# Altium schematic sheet 04.SchDoc
size 817 x 513 mm
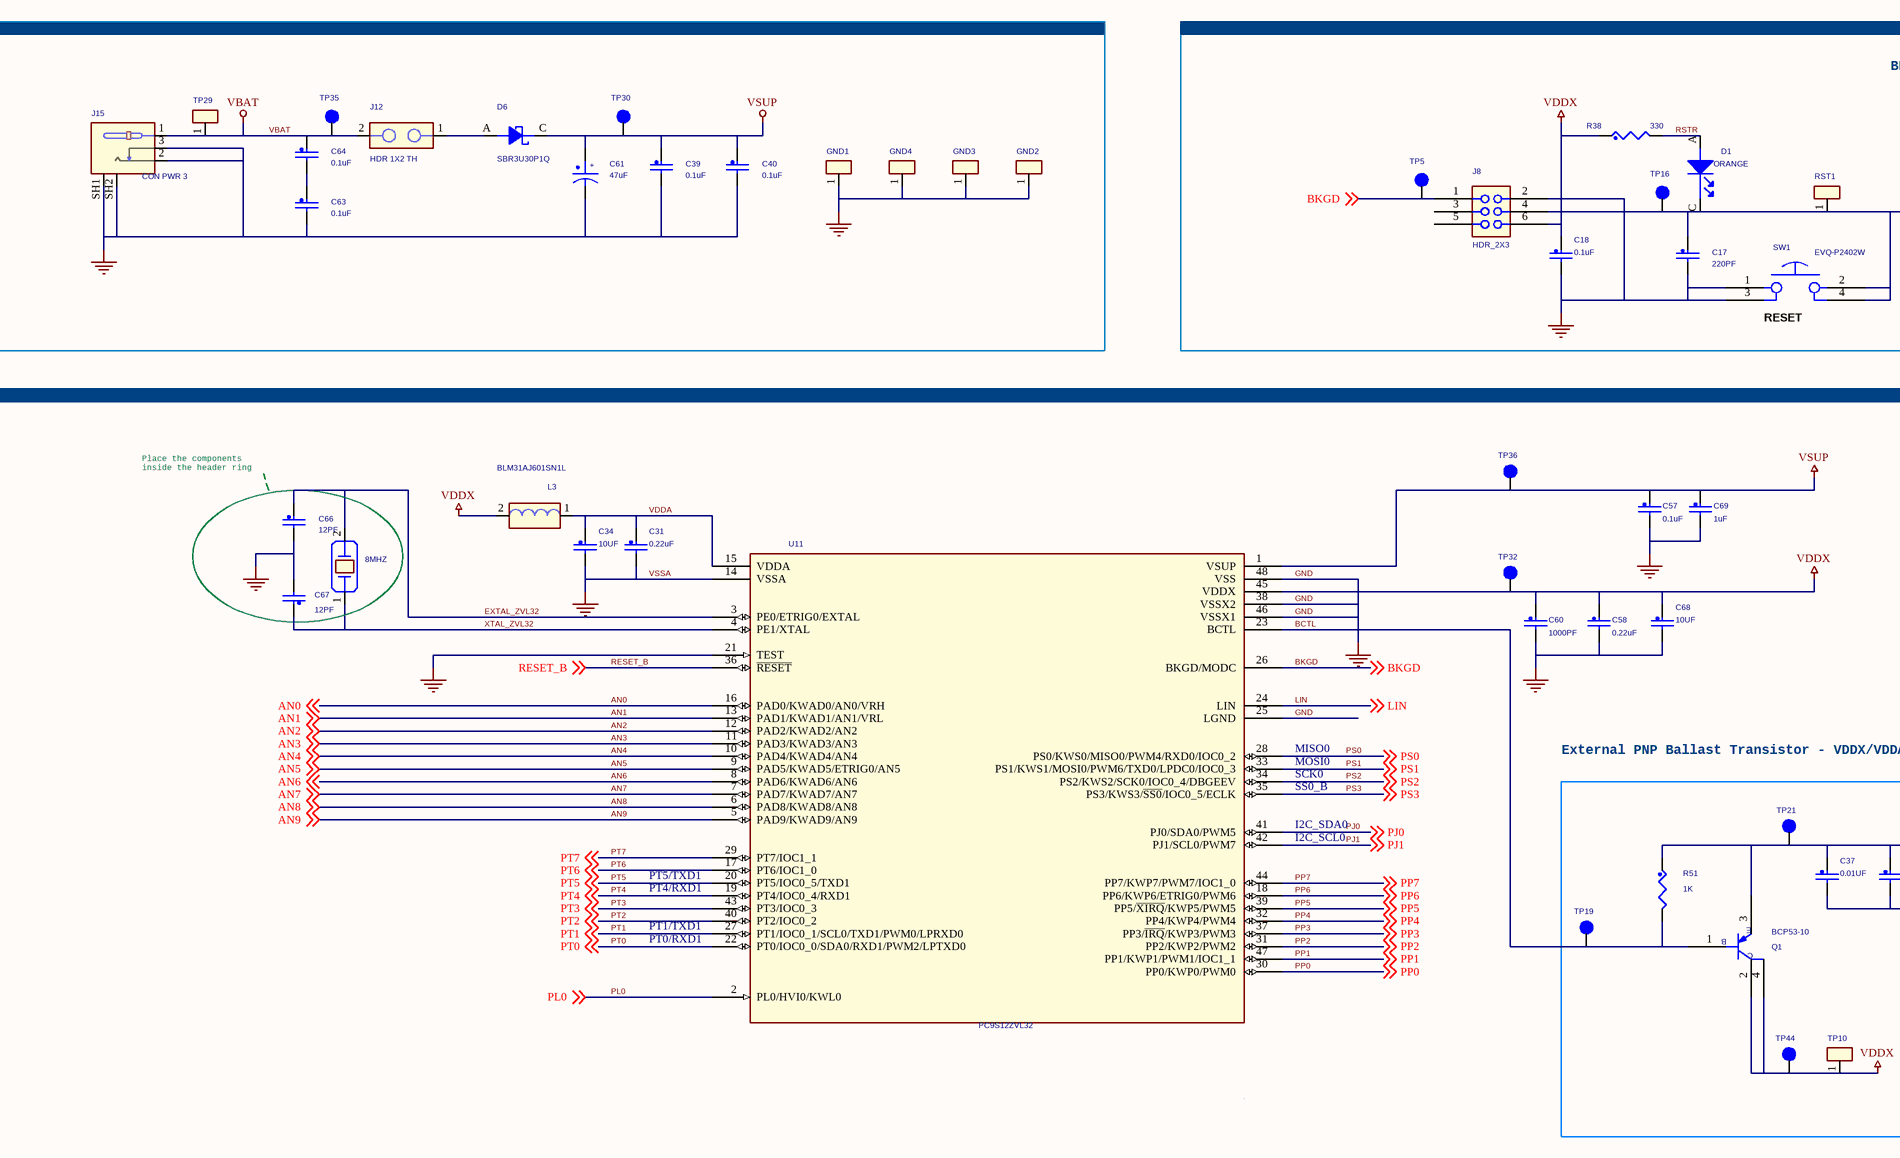
[diagram p0: 04.SchDoc, top left]
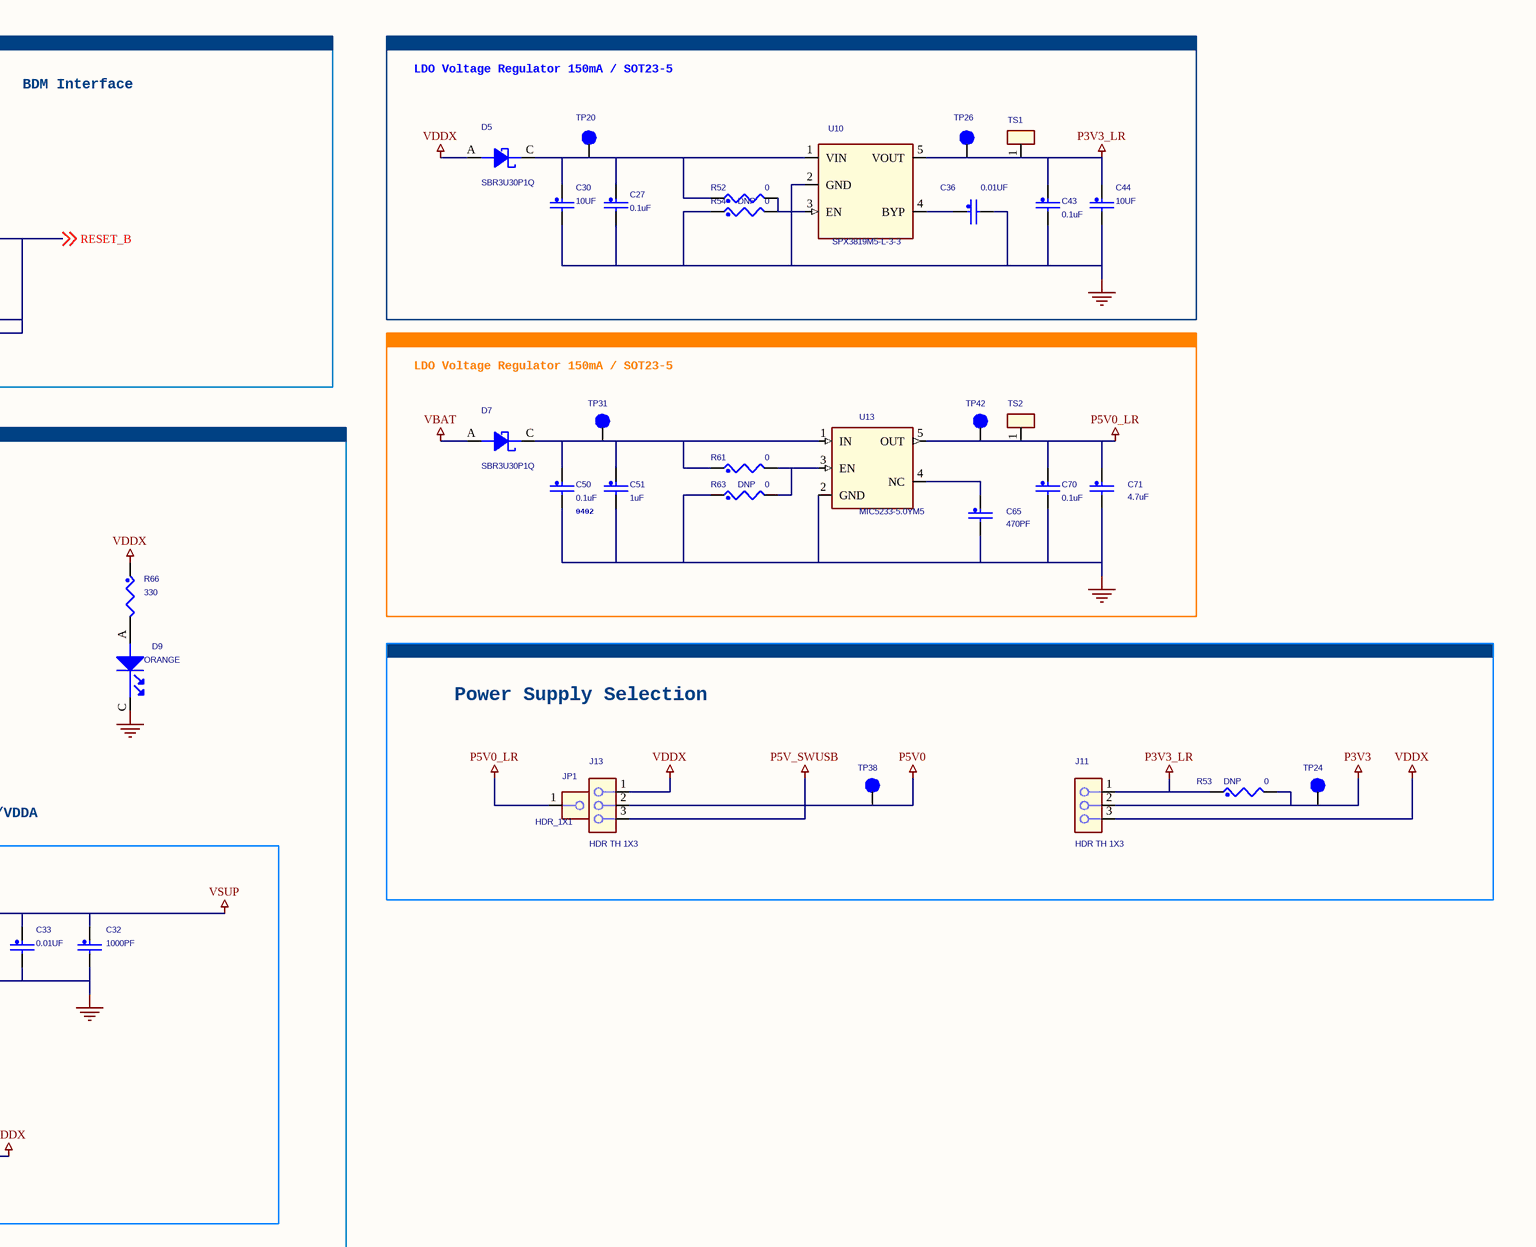
[diagram p1: 04.SchDoc, top right]
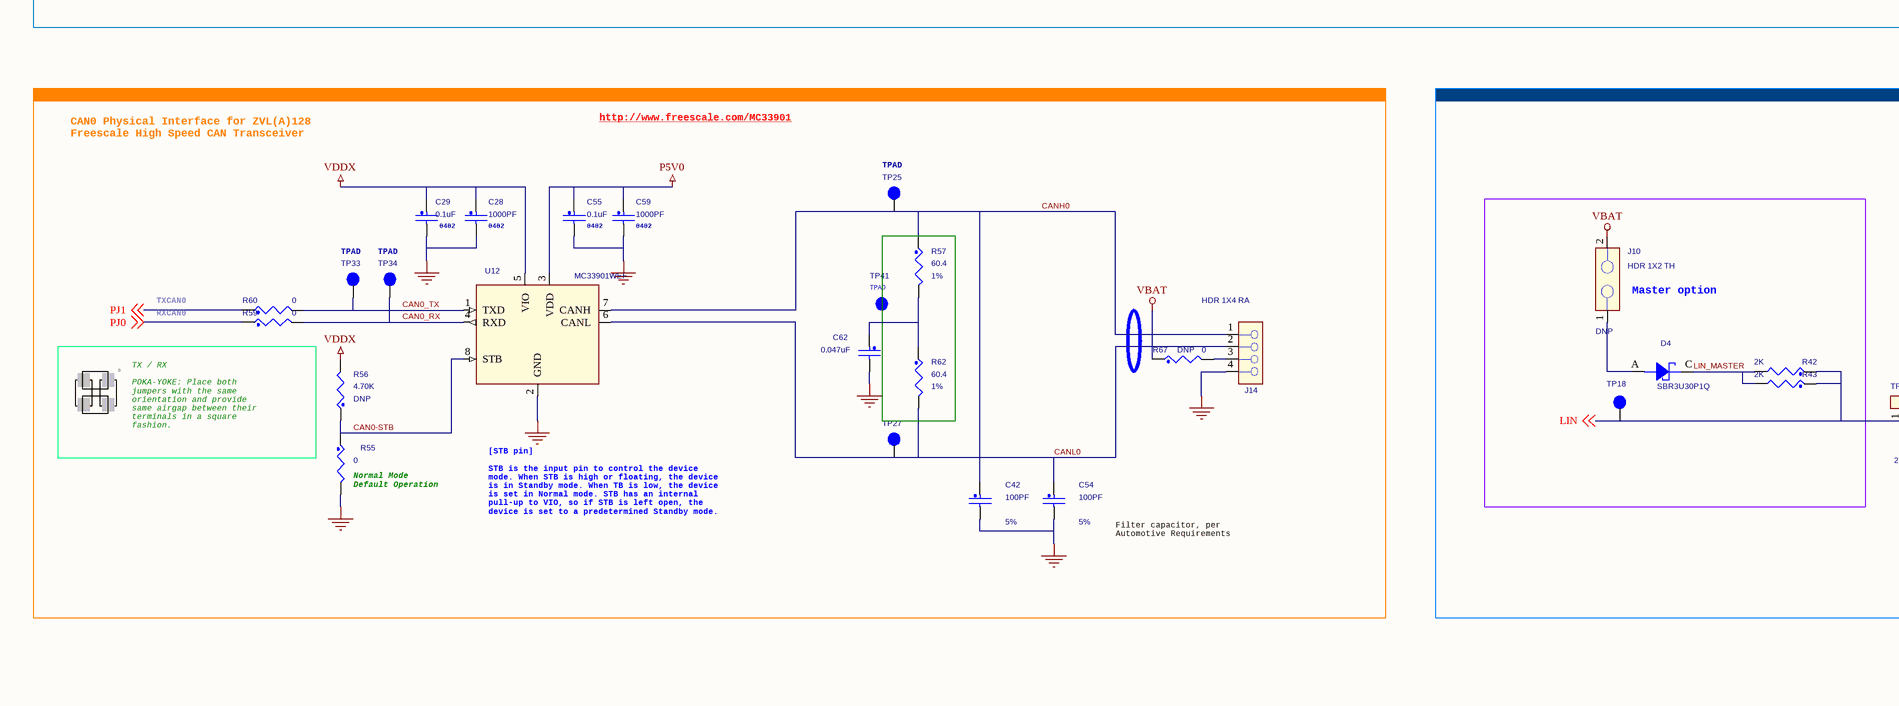
[diagram p2: 04.SchDoc, bottom left]
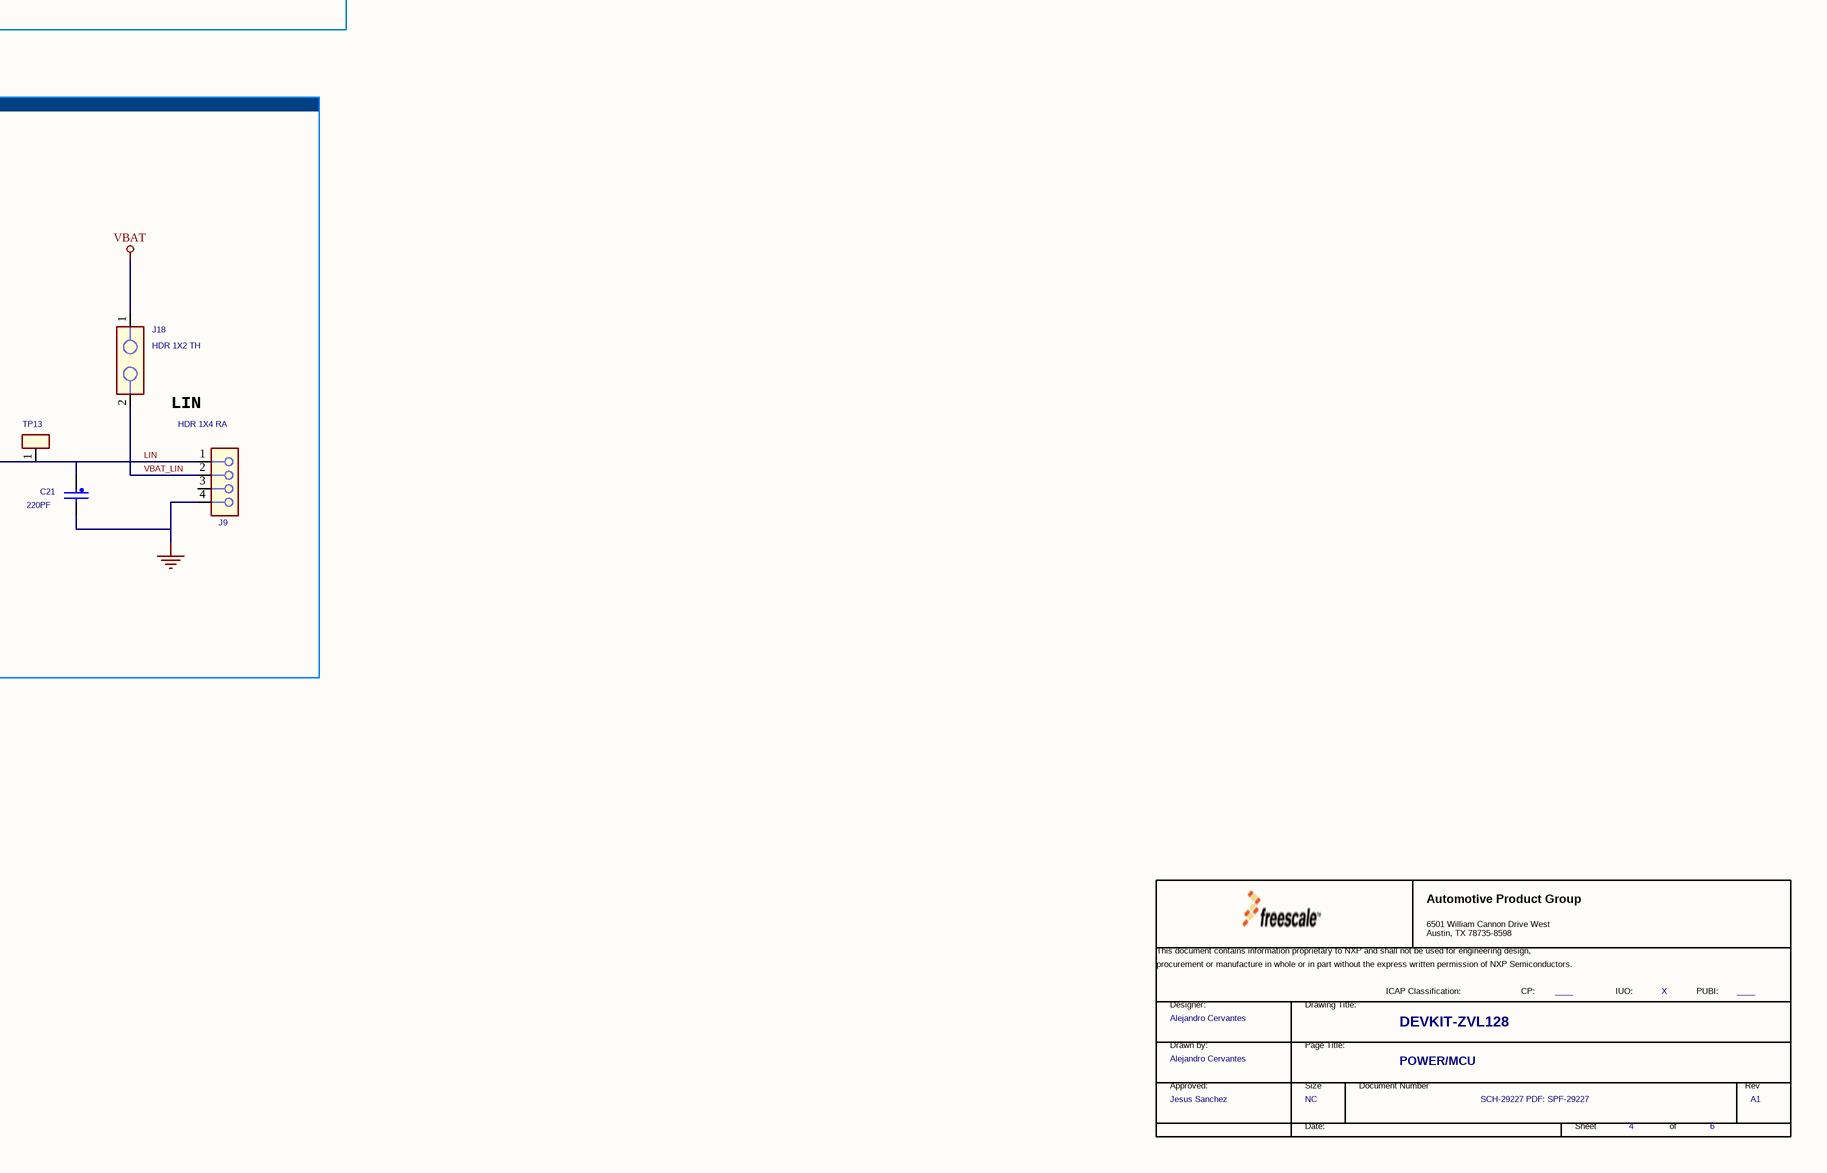
[diagram p3: 04.SchDoc, bottom right]

## Parts
*  FCP: ____  FIUO: X  DrawnBy: Alejandro Cervantes  Approver: Jesus Sanchez  PageTitle: POWER/MCU  Page Count: 6  Page Number: 4  Page Size: NC  Title: DEVKIT-ZVL128  RevCode: A1  Doc: SCH-29227 PDF: SPF-29227  (hidden comment: TitleBlock_AMPG)  (graphical)
C17  220PF  [CC0402_25]
C18  0.1uF  [CC0402_25]
C21  220PF  [CC0603_OV]
C27  0.1uF  [CC0402_25]
C28  1000PF  [CC0402_25]
C29  0.1uF  [CC0402_25]
C30  10UF  [CC0603_OV]
C31  0.22uF  [CC0402_25]
C32  1000PF  [CC0402_25]
C33  0.01UF  [CC0402_25]
C34  10UF  [CC0805_OV]
C36  0.01UF  [CC0402_25]
C37  0.01UF  [CC0402_25]
C39  0.1uF  [CC0402_25]
C40  0.1uF  [CC0402_25]
C42  100PF  TOL: 5%  [CC0402_25]
C43  0.1uF  [CC0402_25]
C44  10UF  [CC0603_OV]
C50  0.1uF  [CC0402_25]
C51  1uF  [CC0805_OV]
C54  100PF  TOL: 5%  [CC0402_25]
C55  0.1uF  [CC0402_25]
C57  0.1uF  [CC0402_25]
C58  0.22uF  [CC0402_25]
C59  1000PF  [CC0402_25]
C60  1000PF  [CC0402_25]
C61  47uF  [cce6p8x6p8]
C62  0.047uF  [CC0603_OV]
C63  0.1uF  [CC0402_25]
C64  0.1uF  [CC0402_25]
C65  470PF  [CC0603_OV]
C66  12PF  [CC0402_25]
C67  12PF  [CC0402_25]
C68  10UF  [CC0805_OV]
C69  1uF  [CC0805_OV]
C70  0.1uF  [CC0402_25]
C71  4.7uF  [CC0805_OV]
D1  ORANGE  [LED_0603]
D4  SBR3U30P1Q  [powerdi-123_3mmx2mm]
D5  SBR3U30P1Q  [powerdi-123_3mmx2mm]
D6  SBR3U30P1Q  [powerdi-123_3mmx2mm]
D7  SBR3U30P1Q  [powerdi-123_3mmx2mm]
D9  ORANGE  [LED_0603]
GND1  TESTLOOP  [testpoint_135_070mil]  (value not drawn)
GND2  TESTLOOP  [testpoint_135_070mil]  (value not drawn)
GND3  TESTLOOP  [testpoint_135_070mil]  (value not drawn)
GND4  TESTLOOP  [testpoint_135_070mil]  (value not drawn)
J8  HDR_2X3  [HDR203]
J9  HDR 1X4 RA  [con_hdr_4m_100_th_ra]
J10  HDR 1X2 TH  ASSY_OPT: DNP  [HDR102]
J11  HDR TH 1X3  [HDR103]
J12  HDR 1X2 TH  [HDR102]
J13  HDR TH 1X3  [HDR103]
J14  HDR 1X4 RA  [con_hdr_4m_100_th_ra]
J15  CON PWR 3  [con3_pwr_jack_th_pj051a]
J18  HDR 1X2 TH  [HDR102]
JP1  HDR_1X1  [HDR101]
L3  BLM31AJ601SN1L  [IND_1206]
Q1  BCP53-10  [sot223]
R38  330  [RC0402_25]
R42  2K  [RC0805_OV]
R43  2K  [RC0805_OV]
R51  1K  [RC0603_OV]
R52  0  [RC0402_25]
R53  0  ASSY_OPT: DNP  [RC0603_OV]
R54  0  ASSY_OPT: DNP  [RC0402_25]
R55  0  [RC0603_OV]
R56  4.70K  ASSY_OPT: DNP  [RC0603_OV]
R57  60.4  TOL: 1%  [RC1210]
R59  0  [RC0603_OV]
R60  0  [RC0603_OV]
R61  0  [RC0603_OV]
R62  60.4  TOL: 1%  [RC1210]
R63  0  ASSY_OPT: DNP  [RC0603_OV]
R66  330  [RC0402_25]
R67  0  ASSY_OPT: DNP  [RC0805_OV]
RST1  TESTLOOP  [testpoint_135_070mil]  (value not drawn)
SW1  EVQ-P2402W  [sw4_spst_4p8X3p6_2p5]
TP5  TPAD_028  [TPAD_028]  (value not drawn)
TP10  TESTLOOP  [testpoint_135_070mil]  (value not drawn)
TP13  TESTLOOP  [testpoint_135_070mil]  (value not drawn)
TP16  TPAD_028  [TPAD_028]  (value not drawn)
TP18  TPAD_028  [TPAD_028]  (value not drawn)
TP19  TPAD_030  [TPAD_030]  (value not drawn)
TP20  TPAD_028  [TPAD_028]  (value not drawn)
TP21  TPAD_030  [TPAD_030]  (value not drawn)
TP24  TPAD_030  [TPAD_030]  (value not drawn)
TP25  TPAD_028  [TPAD_028]  (value not drawn)
TP26  TPAD_028  [TPAD_028]  (value not drawn)
TP27  TPAD_028  [TPAD_028]  (value not drawn)
TP29  TESTLOOP  [testpoint_135_070mil]  (value not drawn)
TP30  TPAD_028  [TPAD_028]  (value not drawn)
TP31  TPAD_030  [TPAD_030]  (value not drawn)
TP32  TPAD_030  [TPAD_030]  (value not drawn)
TP33  TPAD_028  [TPAD_028]  (value not drawn)
TP34  TPAD_028  [TPAD_028]  (value not drawn)
TP35  TPAD_028  [TPAD_028]  (value not drawn)
TP36  TPAD_030  [TPAD_030]  (value not drawn)
TP38  TPAD_030  [TPAD_030]  (value not drawn)
TP41  TPAD_028  [TPAD_028]  (value not drawn)
TP42  TPAD_030  [TPAD_030]  (value not drawn)
TP44  TPAD_030  [TPAD_030]  (value not drawn)
TS1  TESTLOOP  [testpoint_135_070mil]  (value not drawn)
TS2  TESTLOOP  [testpoint_135_070mil]  (value not drawn)
U10  SPX3819M5-L-3-3  [SOT23_5S]
U11  PC9S12ZVL32  [LQFP48]
U12  MC33901WEF  [SO8_1P27_4X5]
U13  MIC5233-5.0YM5  [sot-23-5]
Y2  8MHZ  [xtal2_3p3x2p6]

## Blocks framed on the sheet
BDM Interface: C17 C18 D1 J8 R38 RST1 SW1 TP5 TP16
LDO Voltage Regulator 150mA / SOT23-5: C27 C30 C36 C43 C44 D5 R52 R54 TP20 TP26 TS1 U10
LDO Voltage Regulator 150mA / SOT23-5: C50 C51 C65 C70 C71 D7 R61 R63 TP31 TP42 TS2 U13
External PNP Ballast Transistor - VDDX/VDDA: C31-C34 C37 C57 C58 C60 C66-C69 D9 L3 Q1 R51 R66 TP10 TP19 TP21 TP32 TP36 TP44 U11 Y2
Power Supply Selection: J11 J13 JP1 R53 TP24 TP38
http://www.freescale.com/MC33901: C28 C29 C42 C54 C55 C59 C62 J14 R55-R57 R59 R60 R62 R67 TP25 TP27 TP33 TP34 TP41 U12
LIN: C21 J9 J18 TP13
Master option: D4 J10 R42 R43 TP18

## Nets
GND: C17.2 C18.2 C21.2 C27.2 C28.2 C29.2 C30.2 C31.2 C32.2 C33.2 C34.2 C36.2 C37.2 C39.2 C40.2 C42.2 C43.2 C44.2 C50.2 C51.2 C54.2 C55.2 C57.2 C58.2 C59.2 C60.2 C61.2 C62.2 C63.2 C65.2 C66.2 C67.2 C68.2 C69.2 C70.2 C71.2 D9.C(CATHODE) GND1.1 GND2.1 GND3.1 GND4.1 J8.2(B1) J9.4 J14.4 J15.2 J15.3 J15.SH1(SHIELD1) J15.SH2(SHIELD2) R54.1 R55.2 R63.1 SW1.1 SW1.3 U10.2(GND) U11.14(VSSA) U11.21(TEST) U11.25(LGND) U11.38(VSSX2) U11.46(VSSX1) U11.48(VSS) U12.2(GND) U13.2(GND)  [also labelled VSSA]
P3V3: J11.2 R53.2 TP24.1(Pin1)
P3V3_LR: C43.1 C44.1 J11.1 R53.1 TP26.1(Pin1) TS1.1 U10.5(VOUT)
P5V0: C55.1 C59.1 J13.2 TP38.1(Pin1) U12.3(VDD)
P5V0_LR: C70.1 C71.1 JP1.1 TP42.1(Pin1) TS2.1 U13.5(OUT)
P5V_SWUSB: J13.3
VBAT: C64.1 D7.A J10.2 J12.2 J15.1 J18.1 R67.1 TP29.1 TP35.1(Pin1)
VDDX: C18.1 C28.1 C29.1 C58.1 C60.1 C68.1 D5.A J8.6(B3) J11.3 J13.1 L3.2 Q1.2(COLLECTOR) Q1.4(COLLECTOR1) R38.1 R56.2 R66.1 TP10.1 TP32.1(Pin1) TP44.1(Pin1) U11.45(VDDX) U12.5(VIO)
VSUP: C32.1 C33.1 C37.1 C39.1 C40.1 C57.1 C61.1 C69.1 D6.C Q1.3(EMITTER) R51.1 TP21.1(Pin1) TP30.1(Pin1) TP36.1(Pin1) U11.1(VSUP)
AN0: U11.16(PAD0/KWAD0/AN0/VRH) ; off-sheet AN0
AN1: U11.13(PAD1/KWAD1/AN1/VRL) ; off-sheet AN1
AN2: U11.12(PAD2/KWAD2/AN2) ; off-sheet AN2
AN3: U11.11(PAD3/KWAD3/AN3) ; off-sheet AN3
AN4: U11.10(PAD4/KWAD4/AN4) ; off-sheet AN4
AN5: U11.9(PAD5/KWAD5/ETRIG0/AN5) ; off-sheet AN5
AN6: U11.8(PAD6/KWAD6/AN6) ; off-sheet AN6
AN7: U11.7(PAD7/KWAD7/AN7) ; off-sheet AN7
AN8: U11.6(PAD8/KWAD8/AN8) ; off-sheet AN8
AN9: U11.5(PAD9/KWAD9/AN9) ; off-sheet AN9
BCTL: Q1.1(BASE) R51.2 TP19.1(Pin1) U11.23(BCTL)
BKGD: J8.1(A1) TP5.1(Pin1) U11.26(BKGD/MODC) ; off-sheet BKGD
CAN0-STB: R55.1 R56.1 U12.8(STB)
CAN0_RX: R59.2 TP34.1(Pin1) U12.4(RXD)
CAN0_TX: R60.2 TP33.1(Pin1) U12.1(TXD)
CANH0: C42.1 J14.1 R57.1 TP25.1(Pin1) U12.7(CANH)
CANL0: C54.1 J14.2 R62.2 TP27.1(Pin1) U12.6(CANL)
EXTAL_ZVL32: C66.1 U11.3(PE0/ETRIG0/EXTAL) Y2.2
LIN: C21.1 J9.1 R42.1 R43.1 TP13.1 TP18.1(Pin1) U11.24(LIN) ; off-sheet LIN
LIN_MASTER: D4.C R42.2 R43.2
PJ0: R59.1 U11.41(PJ0/SDA0/PWM5) ; off-sheet PJ0
PJ1: R60.1 U11.42(PJ1/SCL0/PWM7) ; off-sheet PJ1
PL0: U11.2(PL0/HVI0/KWL0) ; off-sheet PL0
PP0: U11.30(PP0/KWP0/PWM0) ; off-sheet PP0
PP1: U11.47(PP1/KWP1/PWM1/IOC1_1) ; off-sheet PP1
PP2: U11.31(PP2/KWP2/PWM2) ; off-sheet PP2
PP3: U11.37(PP3/~{IRQ}/KWP3/PWM3) ; off-sheet PP3
PP4: U11.32(PP4/KWP4/PWM4) ; off-sheet PP4
PP5: U11.39(PP5/~{XIRQ}/KWP5/PWM5) ; off-sheet PP5
PP6: U11.18(PP6/KWP6/ETRIG0/PWM6) ; off-sheet PP6
PP7: U11.44(PP7/KWP7/PWM7/IOC1_0) ; off-sheet PP7
PS0: U11.28(PS0/KWS0/MISO0/PWM4/RXD0/IOC0_2) ; off-sheet PS0
PS1: U11.33(PS1/KWS1/MOSI0/PWM6/TXD0/LPDC0/IOC0_3) ; off-sheet PS1
PS2: U11.34(PS2/KWS2/SCK0/IOC0_4/DBGEEV) ; off-sheet PS2
PS3: U11.35(PS3/KWS3/~{SS0}/IOC0_5/ECLK) ; off-sheet PS3
PT0: U11.22(PT0/IOC0_0/SDA0/RXD1/PWM2/LPTXD0) ; off-sheet PT0
PT1: U11.27(PT1/IOC0_1/SCL0/TXD1/PWM0/LPRXD0) ; off-sheet PT1
PT2: U11.40(PT2/IOC0_2) ; off-sheet PT2
PT3: U11.43(PT3/IOC0_3) ; off-sheet PT3
PT4: U11.19(PT4/IOC0_4/RXD1) ; off-sheet PT4
PT5: U11.20(PT5/IOC0_5/TXD1) ; off-sheet PT5
PT6: U11.17(PT6/IOC1_0) ; off-sheet PT6
PT7: U11.29(PT7/IOC1_1) ; off-sheet PT7
RESET_B: C17.1 D1.C(CATHODE) J8.4(B2) RST1.1 SW1.2 SW1.4 TP16.1(Pin1) U11.36(~{RESET}) ; off-sheet RESET_B
RSTR: D1.A(ANODE) R38.2
VBAT_LIN: J9.2 J18.2
VDDA: C31.1 C34.1 L3.1 U11.15(VDDA)
XTAL_ZVL32: C67.1 U11.4(PE1/XTAL) Y2.1
NetC27_1: C27.1 C30.1 D5.C R52.1 TP20.1(Pin1) U10.1(VIN)
NetC36_1: C36.1 U10.4(BYP)
NetC50_1: C50.1 C51.1 D7.C R61.1 TP31.1(Pin1) U13.1(IN)
NetC62_1: C62.1 R57.2 R62.1 TP41.1(Pin1)
NetC63_1: C63.1 C64.2
NetC65_1: C65.1 U13.4(NC)
NetD4_A: D4.A J10.1
NetD6_A: D6.A J12.1
NetD9_A: D9.A(ANODE) R66.2
NetJ14_3: J14.3 R67.2
NetR52_2: R52.2 R54.2 U10.3(EN)
NetR61_2: R61.2 R63.2 U13.3(EN)

Not connected (* = marked no-connect by the designer): J8 3(A2) 5(A3); J9 3

## Notes on the sheet
- (near SW1) RESET
- (near C66) Place the components
  inside the header ring
- 0402
- MOSI0
- SCK0
- SS0_B
- MISO0
- I2C_SDA0
- I2C_SCL0
- PT1/TXD1
- PT4/RXD1
- PT5/TXD1
- PT0/RXD1
- CAN0 Physical Interface for ZVL(A)128
  Freescale High Speed CAN Transceiver
- (near TP25) TPAD
- TPAD
- (near C29) 0402
- (near C28) 0402
- (near C55) 0402
- (near C59) 0402
- TXCAN0
- RXCAN0
- (near TP41) TPAD
- TX / RX
  POKA-YOKE: Place both
  jumpers with the same
  orientation and provide
  same airgap between their
  terminals in a square
  fashion.
- (near R55) Normal Mode
  Default Operation
- [STB pin]
  STB is the input pin to control the device
  mode. When STB is high or floating, the device
  is in Standby mode. When TB is low, the device
  is set in Normal mode. STB has an internal
  pull-up to VIO, so if STB is left open, the
  device is set to a predetermined Standby mode.
- Filter capacitor, per
  Automotive Requirements
- (in symbol CAP_POL) +
- (in symbol TitleBlock_AMPG) Automotive Product Group; 6501 William Cannon Drive West / Austin, TX 78735-8598; This document contains information proprietary to NXP and shall not be used for engineering design,; procurement or manufacture in whole or in part without the express written permission of NXP Semiconductors.; ICAP Classification:; CP:; IUO:; PUBI:; Designer:; Drawing Title:; Drawn by:; Page Title:; Approved:; Size; Document Number; Rev; Date:; Sheet; of
- (in symbol TRAN_PNP_SOT223) E; B; C

## Library data of the parts
* = TitleBlock_AMPG: OrgName: Freescale Semiconductor; OrgAddr1: 6501 William Cannon Drive West; OrgAddr2: Austin, TX 78735-8598; PUBI: ____; Designer: Alejandro Cervantes; Page Create Date: March  8, 1995
C17 = CAP_NP: CAP CER 220PF 50V 5% C0G 0402; CLASS: DISCRETE; AGILE_PN: 150-30297; MFG_NAME01: KEMET; MFG_PN01: C0402C221J5GAC; CAD_APPROVED: Yes; FPLIST: CC0402_25,CC0402_HD,0402_CC; Tolerance: 5%; ROHS: Yes; HEIGHT: 0.55MM; VOLTAGE: 50V
C18 C27 C40 C43 C63 C64 C70 = CAP_NP: CAP CER 0.1uF 50V 10% X7R 0402; CLASS: DISCRETE; AGILE_PN: 150-79069; MFG_NAME01: MURATA; MFG_PN01: GRM155R71H104KE14D; CAD_APPROVED: Yes; FPLIST: CC0402_25,CC0402_HD,0402_CC; Tolerance: 10%; ROHS: Yes; HEIGHT: 0.55MM; VOLTAGE: 50V
  C18: TOL: 10%
C21 = CAP_NP: CAP CER 220PF 50V 10% X7R 0603; CLASS: DISCRETE; AGILE_PN: 150-75200; MFG_NAME01: KEMET; MFG_PN01: C0603C221K5RAC; CAD_APPROVED: Yes; FPLIST: CC0603_OV,CC0603,0603_CC; Tolerance: 10%; ROHS: Yes; HEIGHT: 0.9652MM; VOLTAGE: 50V
C28 = CAP_NP: CAP CER 1000pF 50V 10% X7R AEC-Q200 0402; CLASS: DISCRETE; AGILE_PN: 150-79040; MFG_NAME01: MURATA; MFG_PN01: GCM155R71H102KA37D; CAD_APPROVED: Yes; FPLIST: CC0402_25,CC0402_HD,0402_CC; TOL: 10%; Tolerance: 10%; ROHS: Yes; HEIGHT: 0.55MM; VOLTAGE: 50V
C29 = CAP_NP: CAP CER 0.1uF 50V 10% X7R 0402; CLASS: DISCRETE; FPLIST: CC0402_25,CC0402_HD,0402_CC; CAD_APPROVED: Yes; MFG_PN01: GRM155R71H104KE14D; MFG_NAME01: MURATA; AGILE_PN: 150-79069; PRIORITY_PN: 021-00295; VOLTAGE: 50V; HEIGHT: 0.55MM; ROHS: Yes; Tolerance: 10%; TOL: 10%
C30 C44 = CAP_NP: CAP CER 10uF 25V 20% X5R 0603; CLASS: DISCRETE; AGILE_PN: 150-79272; MFG_NAME01: Murata; MFG_PN01: GRM188R61E106MA73D; CAD_APPROVED: Yes; FPLIST: CC0805_OV,CC0805,0805_CC; Tolerance: 20%; ROHS: Yes; HEIGHT: 1MM; VOLTAGE: 25V
C31 C58 = CAP_NP: CAP CER 0.22UF 16V 10% X7R 0402; CLASS: DISCRETE; AGILE_PN: 150-78886; MFG_NAME01: Murata; MFG_PN01: GRM155R71C224KA12D; CAD_APPROVED: Yes; FPLIST: CC0402_25,CC0402_HD,0402_CC; Tolerance: 10%; ROHS: Yes; HEIGHT: 0.55MM; VOLTAGE: 16V
C32 = CAP_NP: CAP CER 1000PF 50V 10% X7R 0402; CLASS: DISCRETE; AGILE_PN: 150-75271; Tolerance: +10%; MFG_NAME01: AVX; MFG_PN01: 04025C102KAT2A; CAD_APPROVED: Yes; FPLIST: CC0402_25,CC0402_HD,0402_CC; VOLTAGE: 50VDC; ROHS: Yes; HEIGHT: 0.635 MM
C33 C37 = CAP_NP: CAP CER 0.01uF 50V 5% X7R 0402; CLASS: DISCRETE; AGILE_PN: 150-30234; MFG_NAME01: VENKEL COMPANY; MFG_PN01: C0402X7R500-103JNE; CAD_APPROVED: Yes; FPLIST: CC0402_25,CC0402_HD,0402_CC; TOL: 5%; Tolerance: 5%; ROHS: Yes; HEIGHT: 0.55MM; VOLTAGE: 50V
C34 = CAP_NP: CAP CER 10UF 10V 10% X7R 0805; CLASS: DISCRETE; FPLIST: CC0805_OV,CC0805,0805_CC; CAD_APPROVED: Yes; MFG_PN01: GRM21BR71A106KE51L; MFG_NAME01: Murata; AGILE_PN: 150-78501; VOLTAGE: 10V; HEIGHT: 1.4MM; ROHS: Yes; Tolerance: 10%
C36 = CAP_NP: CAP CER 0.01UF 16V 20% X7R 0402; CLASS: DISCRETE; AGILE_PN: 150-30082; MFG_NAME01: AVX; MFG_PN01: 0402YC103MAT2A; CAD_APPROVED: Yes; FPLIST: CC0402_25,CC0402_HD,0402_CC; TOL: 20%; ROHS: Yes; HEIGHT: 0.56MM; Tolerance: 20%; VOLTAGE: 16V
C39 C50 = CAP_NP: CAP CER 0.1uF 50V 10% X7R 0402; CLASS: DISCRETE; FPLIST: CC0402_25,CC0402_HD,0402_CC; CAD_APPROVED: Yes; MFG_PN01: GRM155R71H104KE14D; MFG_NAME01: MURATA; AGILE_PN: 150-79069; VOLTAGE: 50V; HEIGHT: 0.55MM; ROHS: Yes; Tolerance: 10%
C42 C54 = CAP_NP: CAP CER 100pF 50V 5% C0G AEC-Q200 0402; CLASS: DISCRETE; AGILE_PN: 150-79021; MFG_NAME01: MURATA; MFG_PN01: GCM1555C1H101JA16B; CAD_APPROVED: Yes; FPLIST: CC0402_25,CC0402_HD,0402_CC; ROHS: Yes; HEIGHT: 0.55MM; VOLTAGE: 50V; Tolerance: 5%
C51 = CAP_NP: CAP CER 1uF 50V 10% X7R AEC-Q200 0805; CLASS: DISCRETE; FPLIST: CC0805_OV,CC0805,0805_CC; CAD_APPROVED: Yes; MFG_PN01: GCM21BR71H105KA03; MFG_NAME01: Murata; AGILE_PN: 150-79208; VOLTAGE: 50V; HEIGHT: 1.4MM; ROHS: Yes; Tolerance: 10%
C55 = CAP_NP: CAP CER 0.1uF 50V 10% X7R 0402; CLASS: DISCRETE; PRIORITY_PN: 021-00295; AGILE_PN: 150-79069; MFG_NAME01: MURATA; MFG_PN01: GRM155R71H104KE14D; CAD_APPROVED: Yes; FPLIST: CC0402_25,CC0402_HD,0402_CC; TOL: 10%; Tolerance: 10%; ROHS: Yes; HEIGHT: 0.55MM; VOLTAGE: 50V
C57 = CAP_NP: CAP CER 0.1uF 50V 10% X7R 0402; CLASS: DISCRETE; FPLIST: CC0603_OV,CC0603,0603_CC; CAD_APPROVED: Yes; MFG_PN01: GRM155R71H104KE14D; MFG_NAME01: MURATA; AGILE_PN: 150-79069; VOLTAGE: 50V; HEIGHT: 0.55MM; ROHS: Yes; Tolerance: 10%
C59 = CAP_NP: CAP CER 1000pF 50V 10% X7R AEC-Q200 0402; CLASS: DISCRETE; FPLIST: CC0402_25,CC0402_HD,0402_CC; CAD_APPROVED: Yes; MFG_PN01: GCM155R71H102KA37D; MFG_NAME01: MURATA; AGILE_PN: 150-79040; VOLTAGE: 50V; HEIGHT: 0.55MM; ROHS: Yes; Tolerance: 10%; TOL: 10%
C60 = CAP_NP: CAP CER 1000pF 50V 10% X5R 0402; CLASS: DISCRETE; AGILE_PN: 150-78971; MFG_NAME01: TDK; MFG_PN01: C1005X5R1H102K; CAD_APPROVED: Yes; FPLIST: CC0402_25,CC0402_HD,0402_CC; VOLTAGE: 50%; Tolerance: 10%; ROHS: Yes; HEIGHT: 0.55 MM
C61 = CAP_POL: CAP ALEL 47uF 25V 20% -- SMT; CLASS: DISCRETE; AGILE_PN: 150-79138; MFG_NAME01: NICHICON; MFG_PN01: UUD1E470MCL1GS; CAD_APPROVED: Yes; Tolerance: 20%; ROHS: Yes; HEIGHT: 6.1MM; VOLTAGE: 25V
C62 = CAP_NP: CAP CER 0.047uF 100V 10% X7R 0603; CLASS: DISCRETE; FPLIST: CC0603_OV,CC0603,0603_CC; CAD_APPROVED: Yes; MFG_PN01: C0603C473K1RACTU; MFG_NAME01: Kemet; AGILE_PN: 150-79125; VOLTAGE: 100V; HEIGHT: 0.87MM; ROHS: Yes; Tolerance: 10%
C65 = CAP_NP: CAP CER 470PF 50V 10% X7R 0603; CLASS: DISCRETE; AGILE_PN: 150-75277; MFG_NAME01: AVX; MFG_PN01: 06035C471KAT2A; CAD_APPROVED: YES; FPLIST: CC0603_OV,CC0603,0603_CC; Tolerance: 10%; ROHS: Yes; HEIGHT: 0.9652MM; VOLTAGE: 50V
C66 C67 = CAP_NP: CAP CER 12PF 50V 5% C0G 0402; CLASS: DISCRETE; AGILE_PN: 150-75680; MFG_NAME01: MURATA; MFG_PN01: GRM1555C1H120JZ01D; CAD_APPROVED: Yes; FPLIST: CC0402_25,CC0402_HD,0402_CC; Tolerance: 5%; ROHS: Yes; HEIGHT: 0.55MM; VOLTAGE: 50V
C68 = CAP_NP: CAP CER 10UF 10V 10% X7R 0805; CLASS: DISCRETE; AGILE_PN: 150-78501; MFG_NAME01: Murata; MFG_PN01: GRM21BR71A106KE51L; CAD_APPROVED: Yes; FPLIST: CC0805_OV,CC0805,0805_CC; Tolerance: 10%; ROHS: Yes; HEIGHT: 1.4MM; VOLTAGE: 10V
C69 = CAP_NP: CAP CER 1uF 50V 10% X7R AEC-Q200 0805; CLASS: DISCRETE; AGILE_PN: 150-79208; MFG_NAME01: Murata; MFG_PN01: GCM21BR71H105KA03; CAD_APPROVED: Yes; FPLIST: CC0805_OV,CC0805,0805_CC; Tolerance: 10%; ROHS: Yes; HEIGHT: 1.4MM; VOLTAGE: 50V
C71 = CAP_NP: CAP CER 4.7UF 16V 10% X7R 0805; CLASS: DISCRETE; FPLIST: CC0805_OV,CC0805,0805_CC; CAD_APPROVED: Yes; MFG_PN01: C0805C475K4RACTU; MFG_NAME01: Kemet; AGILE_PN: 150-79241; VOLTAGE: 16V; HEIGHT: 1.4MM; ROHS: Yes; Tolerance: 10%
D1 D9 = LED: LED ULTRA BRIGHT ORANGE 20MA 2V SMT 0603; CLASS: IC; CAD_APPROVED: Yes; MFG_PN01: LTST-C190KFKT; MFG_NAME01: LITE ON; AGILE_PN: 370-75080; HEIGHT: 0.8MM; ROHS: Yes
D4 D5 D7 = DIODE_SCHTKY: DIODE SCH RECT 3A 30V AEC-Q101 POWERDI-123; CLASS: IC; CAD_APPROVED: Yes; MFG_PN01: SBR3U30P1Q-7; MFG_NAME01: DIODES INC; AGILE_PN: 480-78627; HEIGHT: 1MM; ROHS: Yes
D6 = DIODE_SCHTKY: DIODE SCH RECT 3A 30V AEC-Q101 POWERDI-123; CLASS: IC; AGILE_PN: 480-78627; MFG_NAME01: DIODES INC; MFG_PN01: SBR3U30P1Q-7; CAD_APPROVED: Yes; ROHS: Yes; HEIGHT: 1MM
GND1 GND3 GND4 RST1 TP13 TS1 = TEST_POINT: TEST POINT PAD SIZE 3.4MM X 1.8MM SMT; CLASS: IC; PRIORITY_PN: 922-00014; CAD_APPROVED: Yes; MFG_PN01: 5015; MFG_NAME01: KEYSTONE ELECTRONICS; AGILE_PN: 211-75906; HEIGHT: 1.53 MM; ROHS: Yes
GND2 TP10 TP29 TS2 = TEST_POINT: TEST POINT PAD SIZE 3.4MM X 1.8MM SMT; CLASS: IC; AGILE_PN: 211-75906; MFG_NAME01: KEYSTONE ELECTRONICS; MFG_PN01: 5015; CAD_APPROVED: Yes; PRIORITY_PN: 922-00014; ROHS: Yes; HEIGHT: 1.53 MM
J8 = CONN_HDR_3X2: HDR 2X3 TH 100MIL CTR 330H SN 115L; CLASS: IO; CAD_APPROVED: Yes; MFG_PN01: TSW-103-23-T-D; MFG_NAME01: Samtec; AGILE_PN: 210-79360; HEIGHT: 8.58MM; ROHS: Yes
J9 = CONN_HDR_4X1: HDR 1X4 TH RA 100MIL SP 268H AU 124L; CLASS: IO; CAD_APPROVED: Yes; MFG_PN01: 0022122041; MFG_NAME01: MOLEX; AGILE_PN: 210-79929; HEIGHT: 6.81MM; ROHS: Yes
J10 J18 = JUMPER_2_2mm: HDR 1X2 TH 100MIL SP 339H AU 98L; CLASS: IO; FPLIST: HDR102,SH_HDR102_BOTTOM; CAD_APPROVED: YES; MFG_PN01: TSW-102-07-G-S; MFG_NAME01: SAMTEC; AGILE_PN: 210-80468; HEIGHT: 8.71 MM; ROHS: Yes
J11 J13 = CONN_HDR_3X1: HDR 1X3 TH 100MIL SP 339H AU 100L; CLASS: IO; AGILE_PN: 210-80732; MFG_NAME01: SAMTEC; MFG_PN01: TSW-103-07-G-S; CAD_APPROVED: Yes; ROHS: Yes; HEIGHT: 8.65MM
J12 = JUMPER_2_2mm: HDR 1X2 TH 100MIL SP 339H AU 98L; CLASS: IO; AGILE_PN: 210-80468; MFG_NAME01: SAMTEC; MFG_PN01: TSW-102-07-G-S; CAD_APPROVED: YES; FPLIST: HDR102,SH_HDR102_BOTTOM; ROHS: Yes; HEIGHT: 8.71 MM
J14 = CONN_HDR_4X1: HDR 1X4 TH RA 100MIL SP 268H AU 124L; CLASS: IO; AGILE_PN: 210-79929; MFG_NAME01: MOLEX; MFG_PN01: 0022122041; CAD_APPROVED: Yes; ROHS: Yes; HEIGHT: 6.81MM
J15 = DC_POWER_JACK_SHD: CON 3 PWR JACK RA TH 295H -- NI 98L; CLASS: IO; AGILE_PN: 210-79945; MFG_NAME01: CUI INC; MFG_PN01: PJ-051A; CAD_APPROVED: Yes; ROHS: Yes; HEIGHT: 7.5MM
JP1 = CONN_HDR_1X1: HDR 1X1 TH 100MIL SP 338H AU 150L; CLASS: IO; AGILE_PN: 210-80028; MFG_NAME01: SAMTEC; MFG_PN01: HMTSW-101-24-SM-S-230; CAD_APPROVED: Yes; ROHS: Yes; HEIGHT: 8.59MM
L3 = BEAD: IND FER BEAD 600OHM@100MHZ 200MA 25% 1206; PART_TYPE: FERRITE; CLASS: DISCRETE; AGILE_PN: 180-75935; MFG_NAME01: MURATA; CAD_APPROVED: Yes; FPLIST: IND_1206,1206_CC; Tolerance: 25%; MFG_PN01: BLM31AJ601SN1L; ROHS: Yes; HEIGHT: 1.3MM
Q1 = TRAN_PNP_SOT223: TRAN PNP GEN 1.5A 80V SOT-223; CLASS: IC; AGILE_PN: 480-78401; MFG_NAME01: On Semiconductor; MFG_PN01: BCP53-10T1G; CAD_APPROVED: Yes; ROHS: Yes; HEIGHT: 1.75 MM
R38 = RES: RES MF 330 OHM 1/16W 1% AEC-Q200 0402; CLASS: DISCRETE; FPLIST: RC0402_25,RC0402_HD,0402_CC; CAD_APPROVED: Yes; MFG_PN01: RK73H1ETTP3300F; MFG_NAME01: KOA SPEER; AGILE_PN: 470-76465; ROHS: Yes; Tolerance: 1%; HEIGHT: 0.4MM
R42 R43 = RES: RES MF 2K 1/8W 1% 0805; CLASS: DISCRETE; FPLIST: RC0805_OV,RC0805,0805_CC; CAD_APPROVED: Yes; MFG_PN01: CR0805-FX-2001ELF; MFG_NAME01: BOURNS; AGILE_PN: 470-76341; HEIGHT: 0.65MM; ROHS: Yes; Tolerance: 1%
R51 = RES: RES MF 1.0K 1/10W 5% 0603; CLASS: DISCRETE; FPLIST: RC0603_OV,RC0603,0603_CC; CAD_APPROVED: YES; MFG_PN01: CR0603-10W-102JT; MFG_NAME01: VENKEL COMPANY; AGILE_PN: 470-75412; HEIGHT: 0.6MM; TOL: 5%; ROHS: Yes; Tolerance: 5%
R52 = RES: RES MF ZERO OHM 1/16W -- AEC-Q200 0402; CLASS: DISCRETE; AGILE_PN: 470-80742; MFG_NAME01: VISHAY INTERTECHNOLOGY; MFG_PN01: CRCW04020000Z0ED; CAD_APPROVED: Yes; FPLIST: RC0402_25,RC0402_HD,0402_CC; ROHS: Yes; HEIGHT: 0.45 MM
R53 R63 = RES: RES MF ZERO OHM 1/10W -- AEC-Q200 0603; CLASS: DISCRETE; FPLIST: RC0603_OV,RC0603,R603-X2,0603_CC; CAD_APPROVED: Yes; MFG_PN01: RK73Z1JTTD; MFG_NAME01: KOA SPEER; Tolerance: 1%; AGILE_PN: 470-75407; HEIGHT: 0.6MM; ROHS: Yes
R54 = RES: RES MF ZERO OHM 1/16W -- AEC-Q200 0402; CLASS: DISCRETE; FPLIST: RC0402_25,RC0402_HD,0402_CC; CAD_APPROVED: Yes; MFG_PN01: CRCW04020000Z0ED; MFG_NAME01: VISHAY INTERTECHNOLOGY; AGILE_PN: 470-80742; HEIGHT: 0.45 MM; ROHS: Yes
R55 = RES: RES MF ZERO OHM 1/10W -- AEC-Q200 0603; CLASS: DISCRETE; FPLIST: RC0603_OV,RC0603,R603-X2,0603_CC; CAD_APPROVED: Yes; MFG_PN01: RK73Z1JTTD; MFG_NAME01: KOA SPEER; Tolerance: 1%; AGILE_PN: 470-75407; PRIORITY_PN: 006-00371; ROHS: Yes; TOL: 1%; HEIGHT: 0.6MM
R56 = RES: RES MF 4.70K 1/10W 1% 0603; CLASS: DISCRETE; FPLIST: RC0603_OV,RC0603,0603_CC; CAD_APPROVED: Yes; MFG_PN01: RK73H1JTTD4701F; MFG_NAME01: KOA SPEER; AGILE_PN: 470-75430; PRIORITY_PN: 006-00377; ROHS: Yes; Tolerance: 1%; TOL: 1%; HEIGHT: 0.55 MM
R57 = RES: RES MF 60.4 OHM 1/2W 1% 1210; CLASS: DISCRETE; FPLIST: RC1210,1210_CC; CAD_APPROVED: Yes; MFG_PN01: ERJ14NF60R4U; MFG_NAME01: Panasonic; AGILE_PN: 470-80276; HEIGHT: 0.7MM; ROHS: Yes; Tolerance: 1%
R59-R61 = RES: RES MF ZERO OHM 1/10W -- AEC-Q200 0603; CLASS: DISCRETE; AGILE_PN: 470-75407; Tolerance: 1%; MFG_NAME01: KOA SPEER; MFG_PN01: RK73Z1JTTD; CAD_APPROVED: Yes; FPLIST: RC0603_OV,RC0603,R603-X2,0603_CC; HEIGHT: 0.6MM; ROHS: Yes
R62 = RES: RES MF 60.4 OHM 1/2W 1% 1210; CLASS: DISCRETE; AGILE_PN: 470-80276; MFG_NAME01: Panasonic; MFG_PN01: ERJ14NF60R4U; CAD_APPROVED: Yes; FPLIST: RC1210,1210_CC; ROHS: Yes; HEIGHT: 0.7MM; Tolerance: 1%
R66 = RES: RES MF 330 OHM 1/16W 1% AEC-Q200 0402; CLASS: DISCRETE; AGILE_PN: 470-76465; MFG_NAME01: KOA SPEER; MFG_PN01: RK73H1ETTP3300F; CAD_APPROVED: Yes; FPLIST: RC0402_25,RC0402_HD,0402_CC; HEIGHT: 0.4MM; Tolerance: 1%; ROHS: Yes
R67 = RES: RES MF ZERO 1/8W AEC-Q200 0805; CLASS: DISCRETE; FPLIST: RC0805_OV,RC0805,RC0805_OV_3P,0805_CC; CAD_APPROVED: Yes; MFG_PN01: RK73Z2ATTD; MFG_NAME01: KOA SPEER; AGILE_PN: 470-80547; HEIGHT: 0.65 MM; ROHS: Yes
SW1 = EDGE_MOUNT_PB_SW_2: SW SPST PB NO 0.02A 15V SMT; CLASS: IC; AGILE_PN: 510-77992; MFG_NAME01: Panasonic; CAD_APPROVED: Yes; MFG_PN01: EVQ-P2402W; ROHS: Yes; HEIGHT: 2.7 MM
TP5 TP18 TP26 TP33 TP34 TP41 = TestLoop: TEST POINT PAD 28MIL DIA SMT, NO PART TO ORDER; CLASS: IO; CAD_APPROVED: Yes; AGILE_PN: 211-79313; HEIGHT: 0.1 MM; ROHS: Yes; MFG_PN01: N/A; MFG_NAME01: N/A
TP16 TP20 TP25 TP27 TP30 TP35 = TestLoop: TEST POINT PAD 28MIL DIA SMT, NO PART TO ORDER; CLASS: IO; AGILE_PN: 211-79313; CAD_APPROVED: Yes; MFG_NAME01: N/A; MFG_PN01: N/A; ROHS: Yes; HEIGHT: 0.1 MM
TP19 TP21 TP31 TP32 TP44 = TestLoop: TEST POINT PAD 30MIL DIA SMT, NO PART TO ORDER; CLASS: IO; CAD_APPROVED: Yes; MFG_PN01: NOTACOMPONENT; AGILE_PN: 211-76642; HEIGHT: 0.1MM; ROHS: Yes; MFG_NAME01: NOTACOMPONENT
TP24 TP36 TP38 TP42 = TestLoop: TEST POINT PAD 30MIL DIA SMT, NO PART TO ORDER; CLASS: IO; AGILE_PN: 211-76642; MFG_NAME01: NOTACOMPONENT; CAD_APPROVED: Yes; MFG_PN01: NOTACOMPONENT; ROHS: Yes; HEIGHT: 0.1MM
U10 = SPX3819M5_FIX_5P: IC VREG LDO 3.3V 500MA 2.5-16V SOT-23-5; CAD_APPROVED: Yes; MFG_NAME01: EXAR; AGILE_PN: 315-79574; CLASS: IC; HEIGHT: 1.45 MM; ROHS: Yes; MFG_PN01: SPX3819M5-L-3-3
U11 = PC9S12ZVL32: IC MCU 32K FLASH 1K RAM 5.5-18V LQFP48; AGILE_PN: TMP-WF-17785; MFG_NAME01: FREESCALE SEMICONDUCTOR; MFG_PN01: PC912ZVL32F0VLF; PRE_APN: 344-01476; CAD_APPROVED: Yes; VOLTAGE: 6-18V; CLASS: IC; ROHS: Yes; HEIGHT: 1.6 MM
U12 = MC33901WEF-8P_4: IC INTERFACE CAN HS 60KB/S-1MB/S 4.5-5.5V SOIC8; CAD_APPROVED: Yes; MFG_NAME01: FREESCALE SEMICONDUCTOR; AGILE_PN: 312-80788; CLASS: IC; HEIGHT: 1.75MM; ROHS: Yes; MFG_PN01: MC33901WEF
U13 = MIC5233_SOT23_5P: IC VREG LDO 5V 2.3-36V SOT23-5; CAD_APPROVED: Yes; MFG_NAME01: MICREL; AGILE_PN: 315-79687; CLASS: IC; HEIGHT: 1.45 MM; ROHS: Yes; MFG_PN01: MIC5233-5.0YM5
Y2 = XTAL_CS10: XTAL 8MHZ 8pF AEC-Q200 SMD; CLASS: IC; AGILE_PN: 230-77981; MFG_NAME01: NDK; MFG_PN01: NX3225GD-8MHZ-STD-CRA-3; CAD_APPROVED: Yes; ROHS: Yes; HEIGHT: 1MM